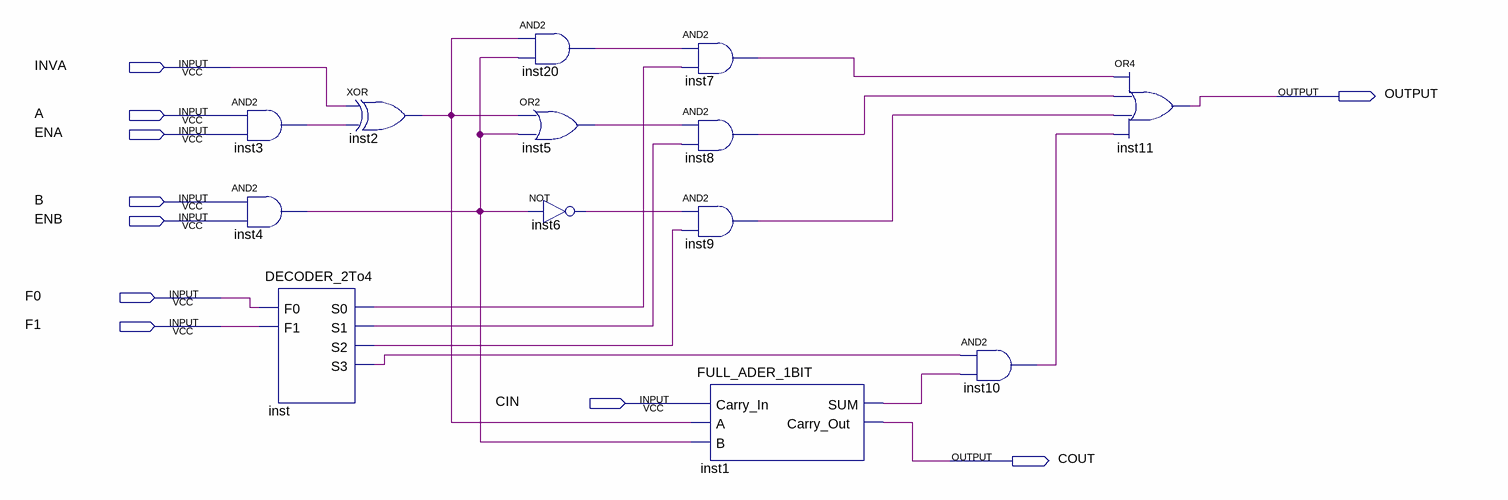
[diagram p0: schematic sheet]
// Quartus schematic ULA_1bit.bdf as structural Verilog: 13 symbols, 10 pins
module ULA_1bit (
  input  INVA,
  input  A,
  input  ENA,
  input  B,
  input  ENB,
  input  F0,
  input  F1,
  input  CIN,
  output OUTPUT,
  output COUT
);

  wire inst1_sum, inst2_out, inst3_out, inst4_out, inst5_out, inst6_out, inst7_out, inst8_out, inst9_out,
       inst10_out, inst20_out, inst_s0, inst_s1, inst_s2, inst_s3;

  and inst3 (inst3_out, A, ENA);
  and inst4 (inst4_out, B, ENB);
  DECODER_2To4 inst (.F0(F0), .F1(F1), .S3(inst_s3), .S2(inst_s2), .S1(inst_s1), .S0(inst_s0));
  xor inst2 (inst2_out, INVA, inst3_out);
  and inst20 (inst20_out, inst2_out, inst4_out);
  or inst5 (inst5_out, inst2_out, inst4_out);
  not inst6 (inst6_out, inst4_out);
  and inst7 (inst7_out, inst20_out, inst_s0);
  and inst8 (inst8_out, inst5_out, inst_s1);
  and inst9 (inst9_out, inst6_out, inst_s2);
  FULL_ADER_1BIT inst1 (.Carry_In(CIN), .A(inst2_out), .B(inst4_out), .SUM(inst1_sum), .Carry_Out(COUT));
  and inst10 (inst10_out, inst_s3, inst1_sum);
  or inst11 (OUTPUT, inst7_out, inst8_out, inst9_out, inst10_out);
endmodule
